# EAGLE design ESP181A (EAGLE 9.1.3)
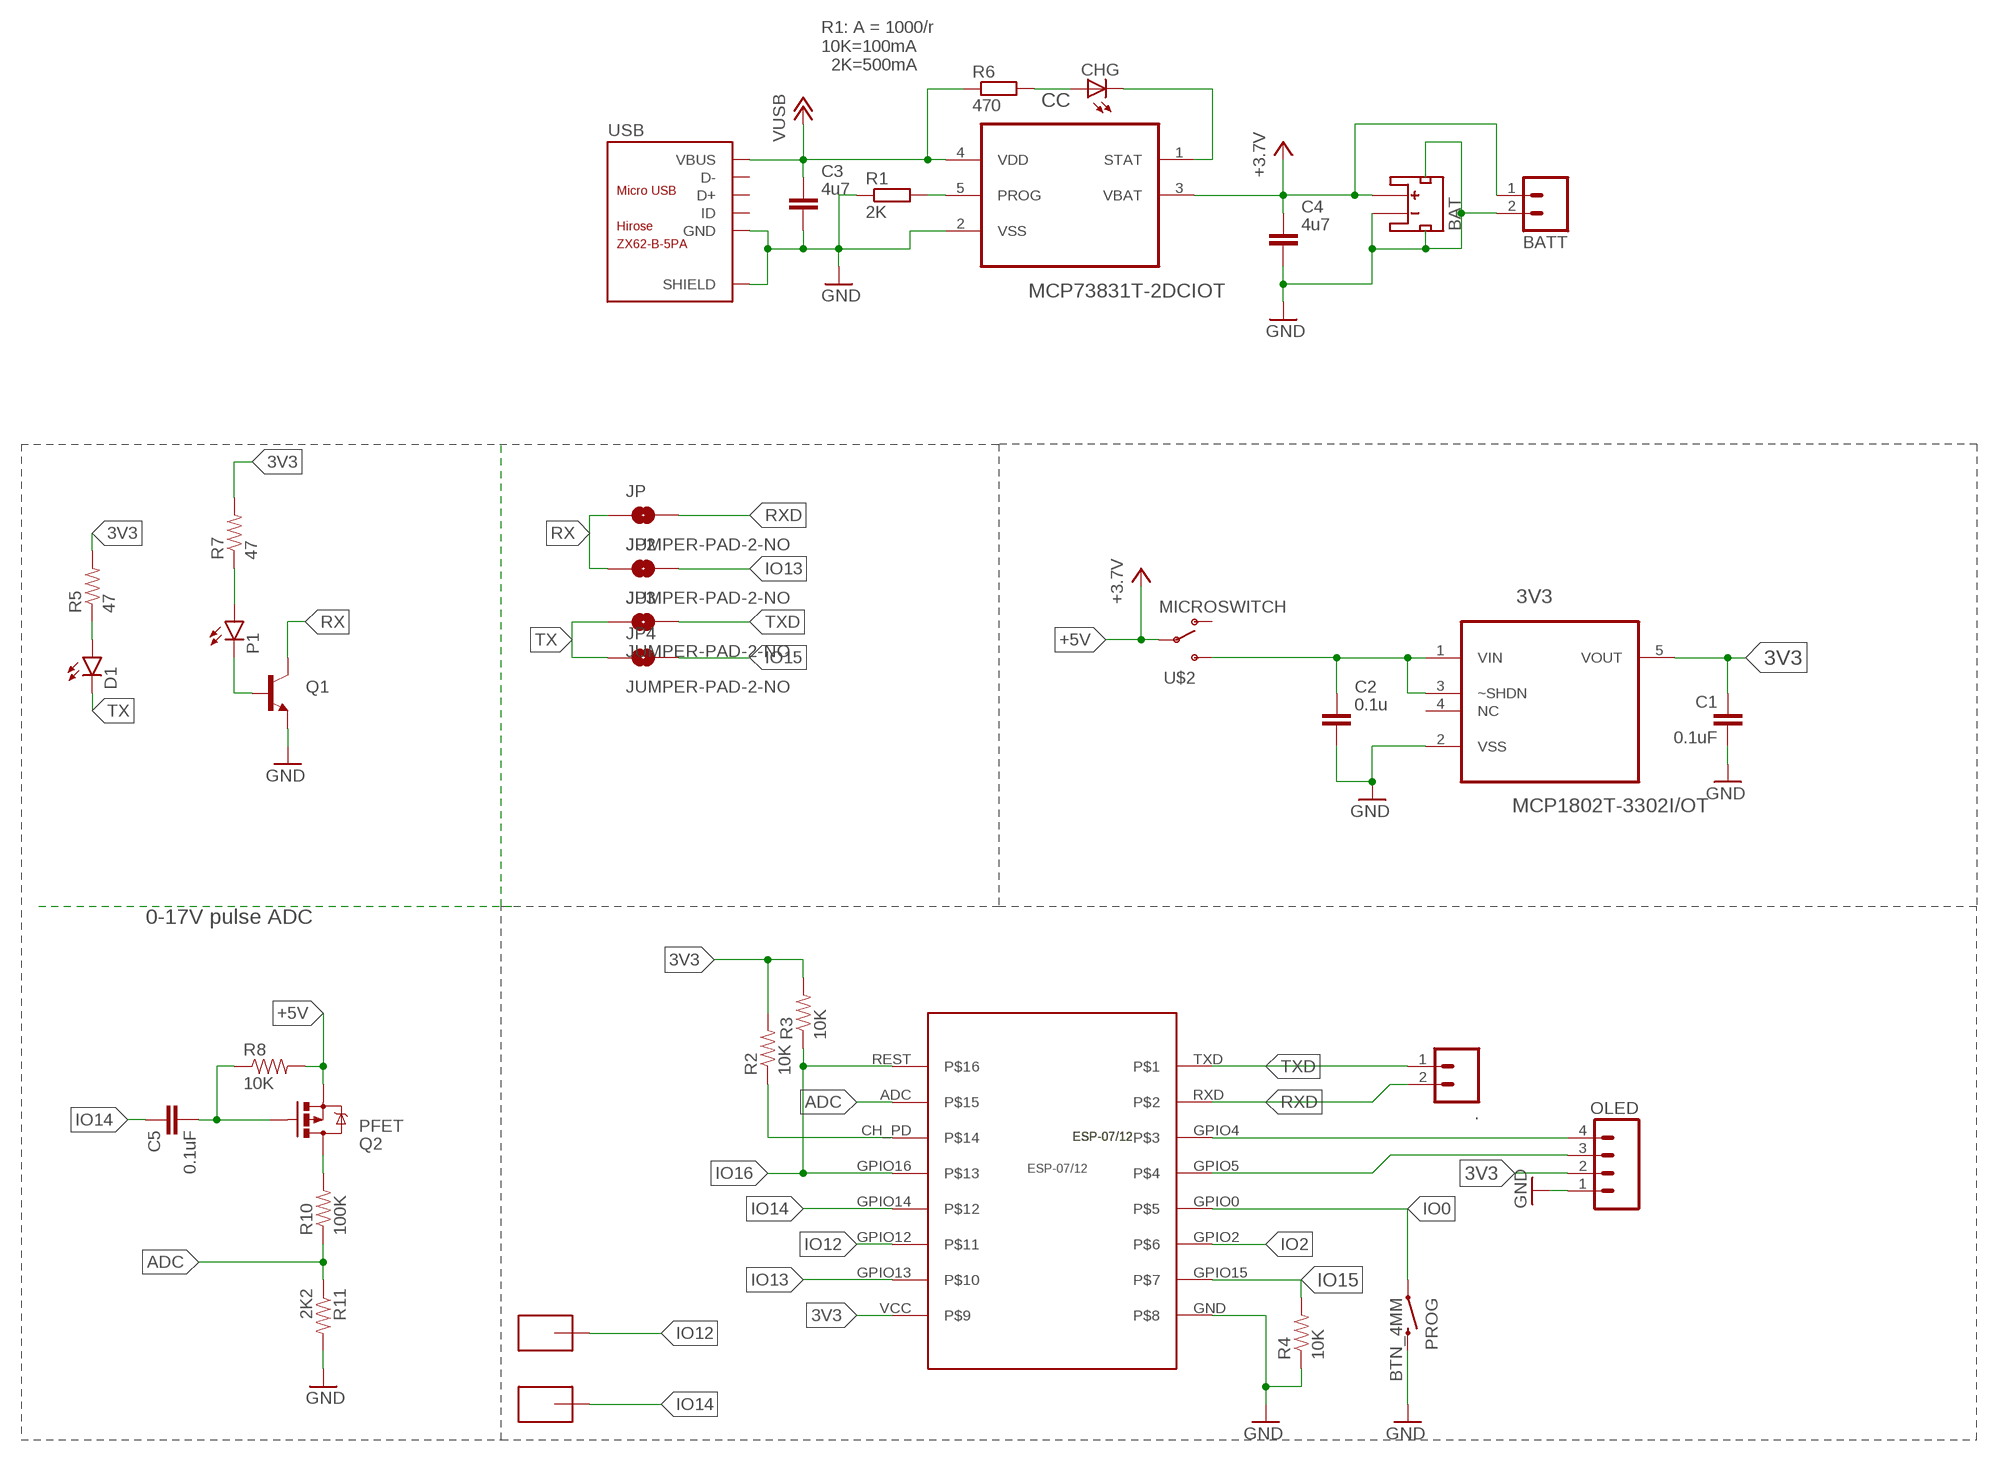
[diagram p0: schematic, sheet 1]

## Parts
3V3  MCP1802T-3302I/OT  MCP1802T-3002I/OT  [SOT95P270X145-5N]
.  M02PTH  [1X02]
BAT  JST1.25MM  [JST_1.25MM]
BATT  M02PTH  [1X02]
C1  0.1uF  CAP  [0805-CAP]
C2  0.1u  CAPACITOR_NPOL-0603  [C603]
C3  4u7  CAPACITOR_NPOL-0603  [C603]
C4  4u7  CAPACITOR_NPOL-0603  [C603]
C5  0.1uF  CAP  [0805-CAP]
CC  MCP73831T-2DCIOT  MCP73832T-2ACI/OT  [SOT95P280X145-5N]
CHG  LEDCHIP-LED0805  [CHIP-LED0805]
D1  LED3MM  [LED3MM]
JP  JUMPER-PAD-2-NO  [PAD-JUMPER-2-NO_NO_SILK]
JP2  JUMPER-PAD-2-NO  [PAD-JUMPER-2-NO_NO_SILK]
JP3  JUMPER-PAD-2-NO  [PAD-JUMPER-2-NO_NO_SILK]
JP4  JUMPER-PAD-2-NO  [PAD-JUMPER-2-NO_NO_SILK]
OLED  M04PTH  [1X04]
P1  LED3MM  [LED3MM]
PROG  BTN_4MM  [BTN_4MM]
Q1  TRANSISTOR_NPNSOT23-3  [SOT23-3]
Q2  PFET  MOSFET-PCHANNEL  [SOT23-3]
R1  2K  RESISTOR-0603  [R603]
R2  10K  RESISTOR0805-RES  [0805]
R3  10K  RESISTOR0805-RES  [0805]
R4  10K  RESISTOR0805-RES  [0805]
R5  47  RESISTOR0805-RES  [0805]
R6  470  RESISTOR-0603  [R603]
R7  47  RESISTOR0805-RES  [0805]
R8  10K  RESISTOR0805-RES  [0805]
R10  100K  RESISTOR0805-RES  [0805]
R11  2K2  RESISTOR0805-RES  [0805]
U$1  ESP-07/12  [ESP-07/12]
U$2  MICROSWITCH  [MICROSWITCH]
U$3  SMD-PAD182X64  [SMD-PAD1]
U$4  SMD-PAD182X64  [SMD-PAD1]
USB  ZX62-B-5PA  MICRO-USB-SMD(ZX62-B-5PA)  [MICRO-USB5+6P-SMD-0.65-AB]

## Nets
3V3: 3V3.5(VOUT) C1.1 OLED.2 R2.2 R3.2 R5.2 R7.2 U$1.VCC
+5V: BAT.2(+) BATT.1 C4.1 CC.3(VBAT) Q2.2(S) R8.2 U$2.2(P) ; supply symbol labelled +3.7V
ADC: R10.1 R11.1 U$1.ADC
CH_PD: R2.1 U$1.CH_PD
GND: 3V3.2(VSS) BAT.1(-) BAT.NC1(PAD1) BAT.NC2(PAD2) BATT.2 C1.2 C2.2 C3.2 C4.2 CC.2(VSS) OLED.1 PROG.2 Q1.2(E) R1.1 R4.1 R11.2 U$1.GND USB.5(GND) USB.P1(SHIELD) USB.P2(SHIELD) USB.P3(SHIELD) USB.P4(SHIELD) USB.P5(SHIELD) USB.P6(SHIELD)
IO0: PROG.1 U$1.GPIO0
IO2: U$1.GPIO2
IO12: U$1.GPIO12 U$4.>PAD
IO13: JP2.2 U$1.GPIO13
IO14: C5.1 U$1.GPIO14 U$3.>PAD
IO15: JP4.2 R4.2 U$1.GPIO15
IO16: R3.1 U$1.GPIO16 U$1.REST
N$1: D1.A R5.1
N$2: P1.K(C) Q1.1(B)
N$3: OLED.4 U$1.GPIO4
N$5: CHG.A R6.2
N$6: CC.1(STAT) CHG.C
N$7: OLED.3 U$1.GPIO5
N$8: CC.5(PROG) R1.2
N$10: 3V3.1(VIN) 3V3.3(~SHDN) C2.1 U$2.3(S)
N$11: P1.A R7.1
N$12: C5.2 Q2.1(G) R8.1
N$13: Q2.3(D) R10.2
RX: JP2.1 JP.1 Q1.3(C)
RXD: ..2 JP.2 U$1.RXD
TX: D1.K(C) JP3.1 JP4.1
TXD: ..1 JP3.2 U$1.TXD
VBUS: C3.1 CC.4(VDD) R6.1 USB.1(VBUS) ; supply symbol labelled VUSB
Unconnected: 3V3.4(NC) U$2.1(O) USB.2(D-) USB.3(D+) USB.4(ID)

## Notes on the sheet
- R1: A = 1000/r
  10K=100mA
    2K=500mA
- 0-17V pulse ADC

## Library data of the parts
3V3 = Microchip_By_element14_Batch_1:MCP1802T-3002I/OT: Low Quiescent Current LDO; MPN: MCP1802T-3002I/OT; OC_FARNELL: 1578373; OC_NEWARK: 54M4837; PACKAGE: SOT-5; SUPPLIER: Microchip
. BATT = SparkFun-Connectors:M02: Standard 2-pin 0.1" header. Use with - straight break away headers ( PRT-00116) - right angle break away headers (PRT-00553) - swiss pins (PRT-00743) - machine pins (PRT-00117) - female headers (PRT-00115) Molex polarized connector foot print use with: PRT-08233 with associated crimp pins and housings. 2.54_SCREWTERM for use with PRT-10571. 3.5mm Screw Terminal footprints for PRT-08084 5mm Screw Terminal footprints for use with PRT-08432
BAT = CuriousTech:JST1.25MM
C1 C5 = SparkFun-Capacitors:CAP: Capacitor Standard 0603 ceramic capacitor, and 0.1" leaded capacitor.
C2-C4 = dp_devices:CAPACITOR_NPOL: Non-Polarized capacitor in various packages
CC = Microchip_By_element14_Batch_1:MCP73832T-2ACI/OT: Charge Management Controller; MPN: MCP73832T-2ACI/OT; OC_FARNELL: 1332159; OC_NEWARK: 88K5656; PACKAGE: SOT-5; SUPPLIER: Microchip
CHG = led:LED: LED OSRAM: - CHIPLED LG R971, LG N971, LY N971, LG Q971, LY Q971, LO R971, LY R971 LH N974, LH R974 LS Q976, LO Q976, LY Q976 LO Q996 - Hyper CHIPLED LW Q18S LB Q993, LB Q99A, LB R99A - SideLED LS A670, LO A670, LY A670, LG A670, LP A670 LB A673, LV A673, LT A673, LW A673 LH A674 LY A675 LS A676, LA A676, LO A676, LY A676, LW A676 LS A679, LY A679, LG A679 - Hyper Micro SIDELED® LS Y876, LA Y876, LO Y876, LY Y876 LT Y87S - SmartLED LW L88C, LW L88S LB L89C, LB L89S, LG L890 LS L89K, LO L89K, LY L89K LS L896, LA L896, LO L896, LY L896 - TOPLED LS T670, LO T670, LY T670, LG T670, LP T670 LSG T670, LSP T670, LSY T670, LOP T670, LYG T670 LG T671, LOG T671, LSG T671 LB T673, LV T673, LT T673, LW T673 LH T674 LS T676, LA T676, LO T676, LY T676, LB T676, LH T676, LSB T676, LW T676 LB T67C, LV T67C, LT T67C, LS T67K, LO T67K, LY T67K, LW E67C LS E67B, LA E67B, LO E67B, LY E67B, LB E67C, LV E67C, LT E67C LW T67C LS T679, LY T679, LG T679 LS T770, LO T770, LY T770, LG T770, LP T770 LB T773, LV T773, LT T773, LW T773 LH T774 LS E675, LA E675, LY E675, LS T675 LS T776, LA T776, LO T776, LY T776, LB T776 LHGB T686 LT T68C, LB T68C - Hyper Mini TOPLED® LB M676 - Mini TOPLED Santana® LG M470 LS M47K, LO M47K, LY M47K Source: http://www.osram.convergy.de LUXEON: - LUMILED® LXK2-PW12-R00, LXK2-PW12-S00, LXK2-PW14-U00, LXK2-PW14-V00 LXK2-PM12-R00, LXK2-PM12-S00, LXK2-PM14-U00 LXK2-PE12-Q00, LXK2-PE12-R00, LXK2-PE12-S00, LXK2-PE14-T00, LXK2-PE14-U00 LXK2-PB12-K00, LXK2-PB12-L00, LXK2-PB12-M00, LXK2-PB14-N00, LXK2-PB14-P00, LXK2-PB14-Q00 LXK2-PR12-L00, LXK2-PR12-M00, LXK2-PR14-Q00, LXK2-PR14-R00 LXK2-PD12-Q00, LXK2-PD12-R00, LXK2-PD12-S00 LXK2-PH12-R00, LXK2-PH12-S00 LXK2-PL12-P00, LXK2-PL12-Q00, LXK2-PL12-R00 Source: www.luxeon.com KINGBRIGHT: KA-3528ASYC Source: www.kingbright.com
D1 P1 = SparkFun-LED:LED: LEDs Standard schematic elements and footprints for 5mm, 3mm, 1206, and 0603 sized LEDs. 5mm - Spark Fun Electronics SKU : COM-00529 (and others); PROD_ID: DIO-08794
JP JP2-JP4 = SparkFun-Passives:JUMPER-PAD-2-NO
OLED = SparkFun-Connectors:M04: Header 4 Standard 4-pin 0.1" header. Use with straight break away headers (SKU : PRT-00116), right angle break away headers (PRT-00553), swiss pins (PRT-00743), machine pins (PRT-00117), and female headers (PRT-00115). Molex polarized connector foot print use with SKU : PRT-08231 with associated crimp pins and housings. 1MM SMD Version SKU: PRT-10208
PROG = CuriousTech:BTN_4MM
Q1 = SparkFun-DiscreteSemi:TRANSISTOR_NPN: Generic NPN BJT MMBT2222A - TRANS-08049 (SOT-23, 1A 40V) MPSA42 - TRANS-09116 (SOT-23, 500mA 300V) MMBT5088LT1G - TRANS-11160 (SOT-23, 50 mA 30V) BC547 - COM-08928 <http://www.sparkfun.com/products/8928> (TO-92 45V 100mA) (1.Collector 2.Base 3.Emitter) 2N3904 - COM-00521 <http://www.sparkfun.com/products/521> (TO-92 40V 200mA) (1.Emitter 2.Base 3.Collector) P2N2222A - COM-12852 <http://www.sparkfun.com/products/12852> (TO-92 40V 600mA) (1.Collector 2.Base 3.Emitter); PROD_ID: TRANS-08049
Q2 = SparkFun-DiscreteSemi:MOSFET-PCHANNEL: Generic PMOSFET IRLML2244 - TRANS-11153 (SOT-23 -20V -4.3A) (1.Gate 2.Source 3.Drain) FQP27P06 - COM-10349 <http://www.sparkfun.com/products/10349> (TO-220 -60V -27A) (1.Gate 2.Source 3.Drain); PROD_ID: TRANS-08285
R1 R6 = dp_devices:RESISTOR
R2-R5 R7 R8 R10 R11 = SparkFun-Resistors:RESISTOR: Resistor Basic schematic elements and footprints for 0603, 1206, and PTH resistors.
U$1 = ESP-07_12:ESP-07/12: Version 1.0 of the library for the ESP-07/12 full GPIO dev board module byME Jon jonnyradu@gmail.com
U$2 = CuriousTech:MICROSWITCH: 2 pole micro switch
U$3 U$4 = CuriousTech:SMD-PAD1: SMD-PAD small
USB = Seeed-OPL-Connector:MICRO-USB-SMD(ZX62-B-5PA): 320010005; MPN: ZX62-B-5PA

## Board
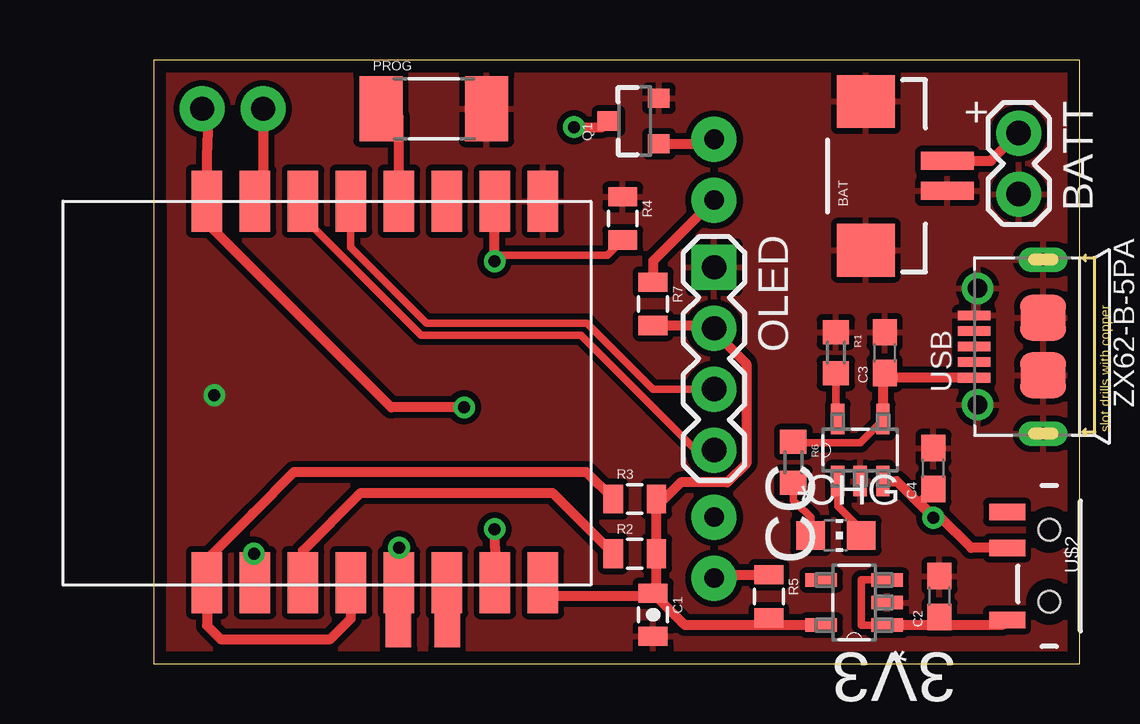
[diagram p1: board, top side]
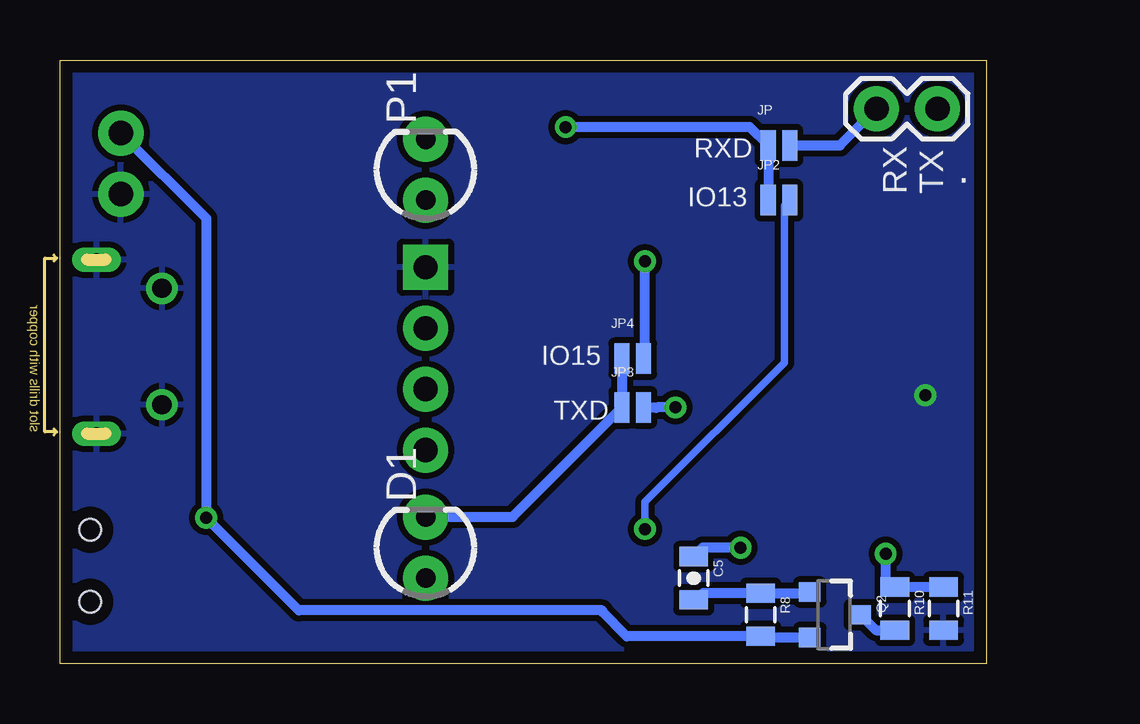
[diagram p2: board, bottom side, seen from below]

Size 38.61 x 25.15 mm. Coordinates in mm from the lower left corner, seen from the top.
Outline: 38.61,0 38.61,25.15 0,25.15 0,0 38.61,0
Copper layers (1*16): Top 0.035mm / dielectric 1.5mm / Bottom 0.035mm
Design rules "default *": minimum track width 10mil, minimum drill 24mil, track to track 8mil, track to pad 8mil, pad to pad 8mil, via to via 8mil, smd to smd 8mil, copper to edge 20mil, drill to drill 8mil, minimum pad ring 10mil, minimum via ring 8mil, stop-mask expansion 4mil, vias tented up to drill 0mil, thermal gap 10mil

### Footprints (pad centres in the part's own frame; a part is rotated, then mirrored left to right if it is on the bottom)
SOT95P270X145-5N = smd 1.321 x 0.559: 1 -1.372,0.94; 2 -1.372,0; 3 -1.372,-0.94; 4 1.372,-0.94; 5 1.372,0.94
1X02 = drill 1.016 pad 1.88: 1 0,0; 2 2.54,0
JST_1.25MM = smd 0.75 x 2.2: 1 -0.625,-1.6; 2 0.625,-1.6 | smd 2.2 x 2.4: NC1 -3.1,1.8; NC2 3.1,1.8
0805-CAP = smd 0.8 x 1.2: 1 -0.9,0; 2 0.9,0
C603 = smd 1.1 x 1: 1 -0.85,0; 2 0.85,0
SOT95P280X145-5N = smd 1.27 x 0.559: 1 -1.295,0.94; 2 -1.295,0; 3 -1.295,-0.94; 4 1.295,-0.94; 5 1.295,0.94
CHIP-LED0805 = smd 1.2 x 1.2: A 0,-1.05; C 0,1.05
LED3MM = drill 0.813 pad 1.88: A -1.27,0; K 1.27,0
PAD-JUMPER-2-NO_NO_SILK = smd 0.635 x 1.27: 1 -0.45,0; 2 0.45,0
1X04 = drill 1.016 pad 1.88 square: 1 0,0 | drill 1.016 pad 1.88: 2 2.54,0; 3 5.08,0; 4 7.62,0
BTN_4MM = smd 1.8 x 2.7: 1 -2.2,0; 2 2.2,0
SOT23-3 = smd 0.8 x 0.9: 1 -0.95,-1; 2 0.95,-1; 3 0,1.1
R603 = smd 1 x 1.1: 1 -0.85,0; 2 0.85,0
0805 = smd 0.8 x 1.2: 1 -0.9,0; 2 0.9,0
ESP-07/12 = smd 2.54 x 1.27: ADC 0.1,14; CH_PD 0.1,12; GND 16,2; GPIO0 16,8; GPIO2 16,6; GPIO4 16,12; GPIO5 16,10; GPIO12 0.1,6; GPIO13 0.1,4; GPIO14 0.1,8; GPIO15 16,4; GPIO16 0.1,10; REST 0.1,16; RXD 16,14; TXD 16,16; VCC 0.1,2
MICROSWITCH = smd 0.7 x 1.5: 1 -2.25,-1.75; 2 -0.75,-1.75; 3 2.25,-1.75 | hole 0.9: -1.5,0; 1.5,0
SMD-PAD1 = smd 2.184 x 1.067: >PAD 0,0
MICRO-USB5+6P-SMD-0.65-AB = smd 0.4 x 1.35: 1 -1.3,2.875; 2 -0.65,2.875; 3 0,2.875; 4 0.65,2.875; 5 1.3,2.875 | smd 1.9 x 1.9: P1 -1.2,0; P2 1.2,0 | drill 0.508 pad 1.016 long: P3 -3.625,0; P4 3.625,0 | drill 0.8: P5 -2.425,2.73; P6 2.425,2.73

### Placement (x,y rotation side)
3V3  29.21,2.54 180 top
.  2.03,23.11 180 bottom
BAT  31.5,20.32 90 top
BATT  36.07,22.1 270 top
C1  20.83,2.03 270 top
C2  32.77,2.79 90 top
C3  30.48,12.95 90 top
C4  32.51,8.13 90 top
C5  12.19,3.56 270 bottom
CC  29.46,8.89 90 top
CHG  28.45,5.33 270 top
D1  23.37,4.83 90 bottom
JP  8.64,21.59 0 bottom
JP2  8.64,19.3 0 bottom
JP3  14.73,10.67 0 bottom
JP4  14.73,12.7 0 bottom
OLED  23.37,16.51 270 top
P1  23.37,20.57 90 bottom
PROG  11.68,23.11 0 top
Q1  20.07,22.61 90 top
Q2  6.35,2.03 270 bottom
R1  28.45,12.95 270 top
R2  20.07,4.57 0 top
R3  20.07,6.86 0 top
R4  19.56,18.54 270 top
R5  25.65,2.79 270 top
R6  26.67,8.38 270 top
R7  20.83,14.99 270 top
R8  9.4,2.03 270 bottom
R10  3.81,2.29 270 bottom
R11  1.78,2.29 270 bottom
U$1  18.23,3.27 90 top
U$2  37.34,4.06 270 top
U$3  10.21,1.78 90 top
U$4  12.24,1.78 90 top
USB  37.08,13.21 90 top

### Tracks (layer width: path | path; a pad name or v marks a point on that pad's centre or on a via)
3V3
  Top 0.406: U$1.VCC 16.8,2.79 20.69,2.79 C1.1 | C1.1 22.16,1.6 25.65,1.6 | 25.65,1.6 R5.2 | 3V3.5 25.65,1.6 | C1.1 20.97,3.07 R2.2 R3.2 21.3,6.86 21.98,7.54 23.93,7.54 24.71,8.33 24.71,12.5 23.37,13.84 OLED.2 23.25,14.09 R7.2
+5V  (via drill 0.5)
  Top 0.406: CC.3 30.99,7.59 v32.51,6.07 32.58,6.07 | 32.58,6.07 32.83,6.07 34.09,4.81 U$2.2 | C4.1 31.94,6.71 32.58,6.07 | BAT.2 34.91,20.95 BATT.1
  Bottom 0.406: BATT.1 32.51,18.54 v32.51,6.07 28.65,2.21 16,2.21 16,2.15 14.99,1.13 R8.2 9.35,1.08 Q2.2
ADC  (via drill 0.5)
  Top 0.406: U$1.ADC 4.23,4.57 v4.19,4.57
  Bottom 0.406: R11.1 R10.1 4.19,3.21 v4.19,4.57
CH_PD
  Top 0.406: R2.1 16.63,7.11 8.64,7.11 6.23,4.71 U$1.CH_PD
GND  (via drill 0.5)
  other vias: 2.54,11.18
  pour Top (isolate 0.254): 0,0 0,25.15 38.61,25.15 38.61,0
  pour Bottom (isolate 0.254): 38.61,0 0,0 0,25.15 38.61,25.15
IO0
  Top 0.406: U$1.GPIO0 10.23,21.08 10.23,22.78 PROG.1
IO12
  Top 0.305: U$1.GPIO12 U$4.>PAD
IO13  (via drill 0.5)
  Top 0.406: U$1.GPIO13 14.23,4.86 14.22,4.87 v14.22,5.6
  Bottom 0.305: JP2.2 8.41,19.08 8.41,12.54 14.22,6.73 v14.22,5.6
IO14  (via drill 0.5)
  Top 0.305: U$3.>PAD 10.21,3.35 U$1.GPIO14
  Top 0.406: v10.24,4.83 10.08,3.48 10.21,3.35
  Bottom 0.406: v10.24,4.83 11.68,4.83 11.82,4.83 C5.1
IO15  (via drill 0.5)
  Top 0.305: v14.22,16.76 14.48,17.02 18.81,17.02 18.94,17.02 R4.2
  Top 0.406: v14.22,16.76 U$1.GPIO15
  Bottom 0.406: JP4.2 14.22,12.76 v14.22,16.76
IO16
  Top 0.406: R3.1 18.05,7.98 5.85,7.98 4.14,6.27 2.23,4.35 U$1.REST 2.23,1.58 2.79,1.02 7.37,1.02 8.23,1.88 U$1.GPIO16
N$1
  Top 0.406: R5.1 23.51,3.69 D1.A
N$2
  Top 0.406: Q1.1 23.18,21.66 P1.K
N$3
  Top 0.305: U$1.GPIO4 6.48,19.02 6.48,18.36 11.16,13.67 17.83,13.67 20.83,10.67 22.61,8.89 OLED.4
N$5
  Top 0.305: R6.2 26.67,6.79 26.81,6.68 27.4,6.1 CHG.A
N$6
  Top 0.305: CC.1 28.52,6.56 29.5,5.59 CHG.C
N$7
  Top 0.305: U$1.GPIO5 8.22,17.34 11.39,14.18 18.08,14.18 20.83,11.43 OLED.3
N$8
  Top 0.305: CC.5 28.45,10.26 R1.2
N$10
  Top 0.305: 3V3.3 29.52,3.48 29.52,1.6 3V3.1
  Top 0.406: 32.77,1.6 33.02,1.6 35.37,1.6 U$2.3 | C2.1 32.77,1.6 | 32.77,1.6 3V3.1
N$11
  Top 0.406: P1.A 20.83,16.76 R7.1
N$12
  Bottom 0.406: C5.2 11.8,2.93 R8.1 7.4,2.93 Q2.1
N$13
  Bottom 0.406: R10.2 4.6,1.39 Q2.3
RX  (via drill 0.5)
  Top 0.406: v17.53,22.35 18.71,22.35 Q1.3
  Bottom 0.406: v17.53,22.35 9.85,22.35 JP.1 JP2.1
RXD
  Top 0.406: U$1.RXD 4.06,19.1 4.57,19.61 ..2
  Bottom 0.406: ..2 6.1,21.59 JP.2
TX
  Bottom 0.406: JP4.1 JP3.1 19.74,6.11 23.36,6.11 D1.K
TXD  (via drill 0.5)
  Top 0.406: ..1 2.3,22.71 2.23,21.14 U$1.TXD 2.23,18.34 9.91,10.67 v12.95,10.67
  Bottom 0.406: v12.95,10.67 13.72,10.67 13.74,10.64 13.77,10.67 JP3.2
VBUS
  Top 0.305: CC.4 30.4,10.14 29.46,9.2 26.67,9.2 R6.1
  Top 0.406: USB.1 30.68,11.91 C3.1 30.4,12.03 CC.4

### Text on the board
tPlace: +
bPlace: RXD | RX / TX | IO13 | IO15 | TXD
bStop: CuriousTech.net | UT181A WiFi